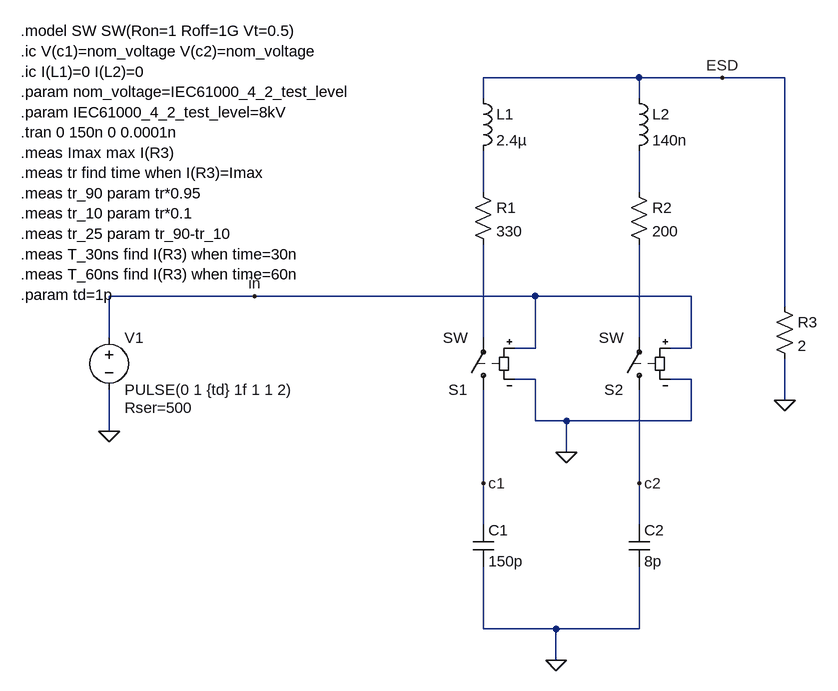
[diagram p0: schematic ESD.asc]
ESD.asc, the LTspice schematic file:
Version 4
SHEET 1 880 1028
WIRE 128 -48 -112 -48
WIRE 256 -48 128 -48
WIRE 352 -48 256 -48
WIRE -112 -16 -112 -48
WIRE 128 -16 128 -48
WIRE -112 128 -112 64
WIRE 128 128 128 64
WIRE -464 288 -688 288
WIRE -32 288 -464 288
WIRE 208 288 -32 288
WIRE 352 304 352 -48
WIRE -688 352 -688 288
WIRE -112 352 -112 208
WIRE 128 352 128 208
WIRE -32 368 -32 288
WIRE -32 368 -64 368
WIRE 208 368 208 288
WIRE 208 368 176 368
WIRE -32 416 -64 416
WIRE 208 416 176 416
WIRE 352 448 352 384
WIRE -32 480 -32 416
WIRE 16 480 -32 480
WIRE 208 480 208 416
WIRE 208 480 16 480
WIRE -688 496 -688 432
WIRE 16 528 16 480
WIRE -112 576 -112 432
WIRE 128 576 128 432
WIRE -112 640 -112 576
WIRE 128 640 128 576
WIRE -112 800 -112 704
WIRE 0 800 -112 800
WIRE 128 800 128 704
WIRE 128 800 0 800
WIRE 0 848 0 800
FLAG 0 848 0
FLAG 16 528 0
FLAG -688 496 0
FLAG 256 -48 ESD
FLAG 352 448 0
FLAG -464 288 in
FLAG -112 576 c1
FLAG 128 576 c2
SYMBOL ind -128 -32 R0
SYMATTR InstName L1
SYMATTR Value 2.4µ
SYMBOL ind 112 -32 R0
SYMATTR InstName L2
SYMATTR Value 140n
SYMBOL res -128 112 R0
SYMATTR InstName R1
SYMATTR Value 330
SYMBOL res 112 112 R0
SYMATTR InstName R2
SYMATTR Value 200
SYMBOL sw -112 448 R180
SYMATTR InstName S1
SYMBOL sw 128 448 R180
SYMATTR InstName S2
SYMBOL cap -128 640 R0
SYMATTR InstName C1
SYMATTR Value 150p
SYMBOL cap 112 640 R0
SYMATTR InstName C2
SYMATTR Value 8p
SYMBOL voltage -688 336 R0
WINDOW 123 0 0 Left 0
WINDOW 39 24 124 Left 2
SYMATTR SpiceLine Rser=500
SYMATTR InstName V1
SYMATTR Value PULSE(0 1 {td} 1f 1 1 2)
SYMBOL res 336 288 R0
SYMATTR InstName R3
SYMATTR Value 2
TEXT -824 -120 Left 2 !.model SW SW(Ron=1 Roff=1G Vt=0.5)\n.ic V(c1)=nom_voltage V(c2)=nom_voltage\n.ic I(L1)=0 I(L2)=0\n.param nom_voltage=IEC61000_4_2_test_level\n.param IEC61000_4_2_test_level=8kV\n.tran 0 150n 0 0.0001n\n.meas Imax max I(R3)\n.meas tr find time when I(R3)=Imax\n.meas tr_90 param tr*0.95\n.meas tr_10 param tr*0.1\n.meas tr_25 param tr_90-tr_10\n.meas T_30ns find I(R3) when time=30n\n.meas T_60ns find I(R3) when time=60n\n.param td=1p

The netlist it stands for:
* ESD.asc
L1 ESD N001 2.4µ
L2 ESD N002 140n
R1 N001 N003 330
R2 N002 N004 200
S1 c1 N003 in 0 SW
S2 c2 N004 in 0 SW
C1 c1 0 150p
C2 c2 0 8p
V1 in 0 PULSE(0 1 {td} 1f 1 1 2) Rser=500
R3 ESD 0 2
.model SW SW(Ron=1 Roff=1G Vt=0.5)
.ic V(c1)=nom_voltage V(c2)=nom_voltage
.ic I(L1)=0 I(L2)=0
.param nom_voltage=IEC61000_4_2_test_level
.param IEC61000_4_2_test_level=8kV
.tran 0 150n 0 0.0001n
.meas Imax max I(R3)
.meas tr find time when I(R3)=Imax
.meas tr_90 param tr*0.95
.meas tr_10 param tr*0.1
.meas tr_25 param tr_90-tr_10
.meas T_30ns find I(R3) when time=30n
.meas T_60ns find I(R3) when time=60n
.param td=1p
.backanno
.end